# EAGLE design EEG-EMG_V1 (EAGLE 7.6.0)
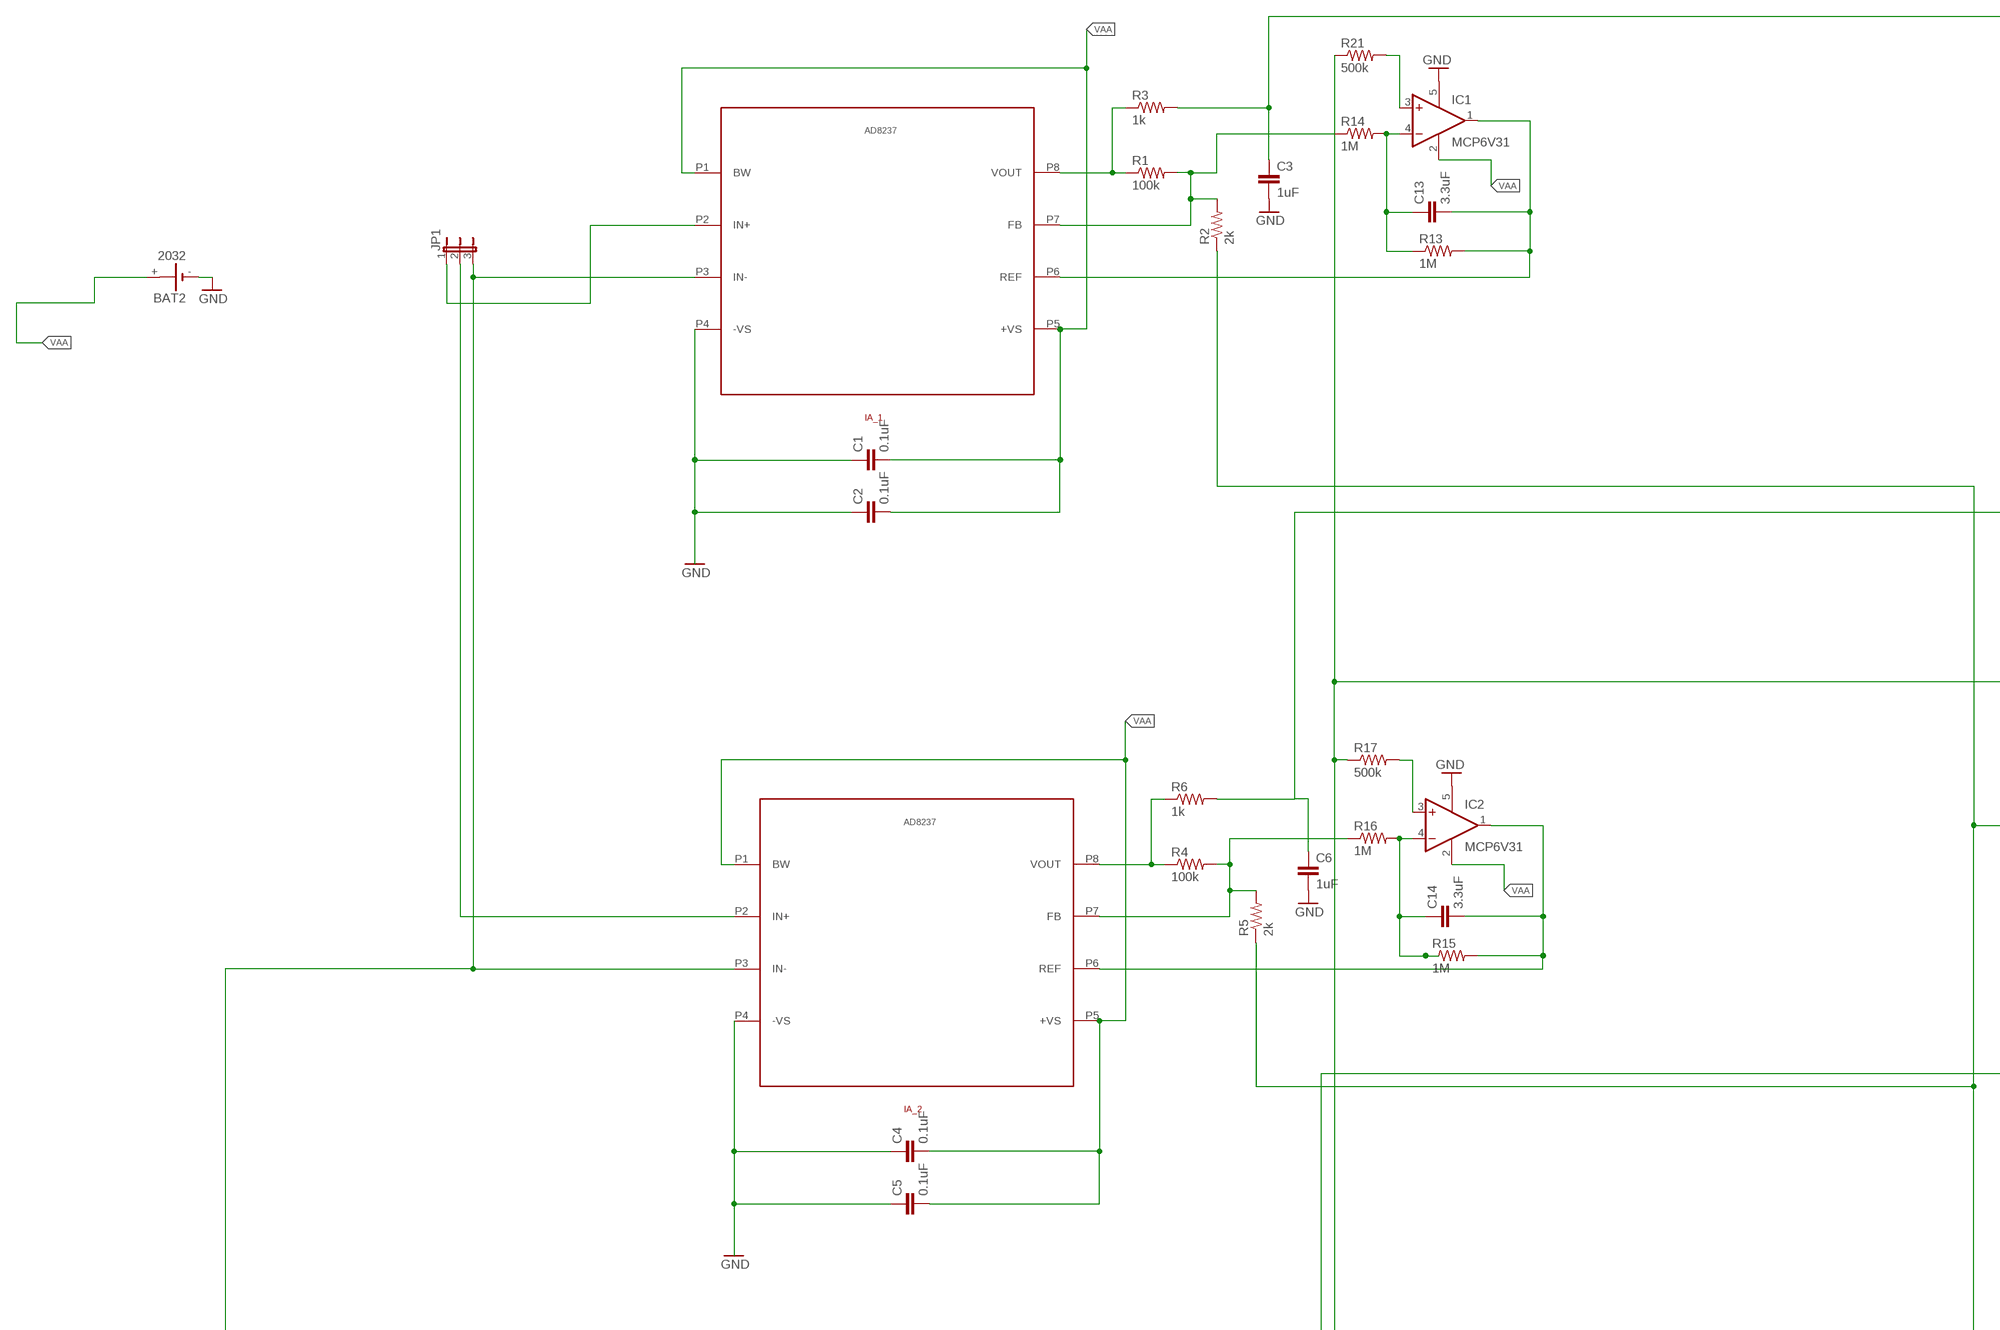
[diagram p0: schematic, sheet 1, part 1 of 3]
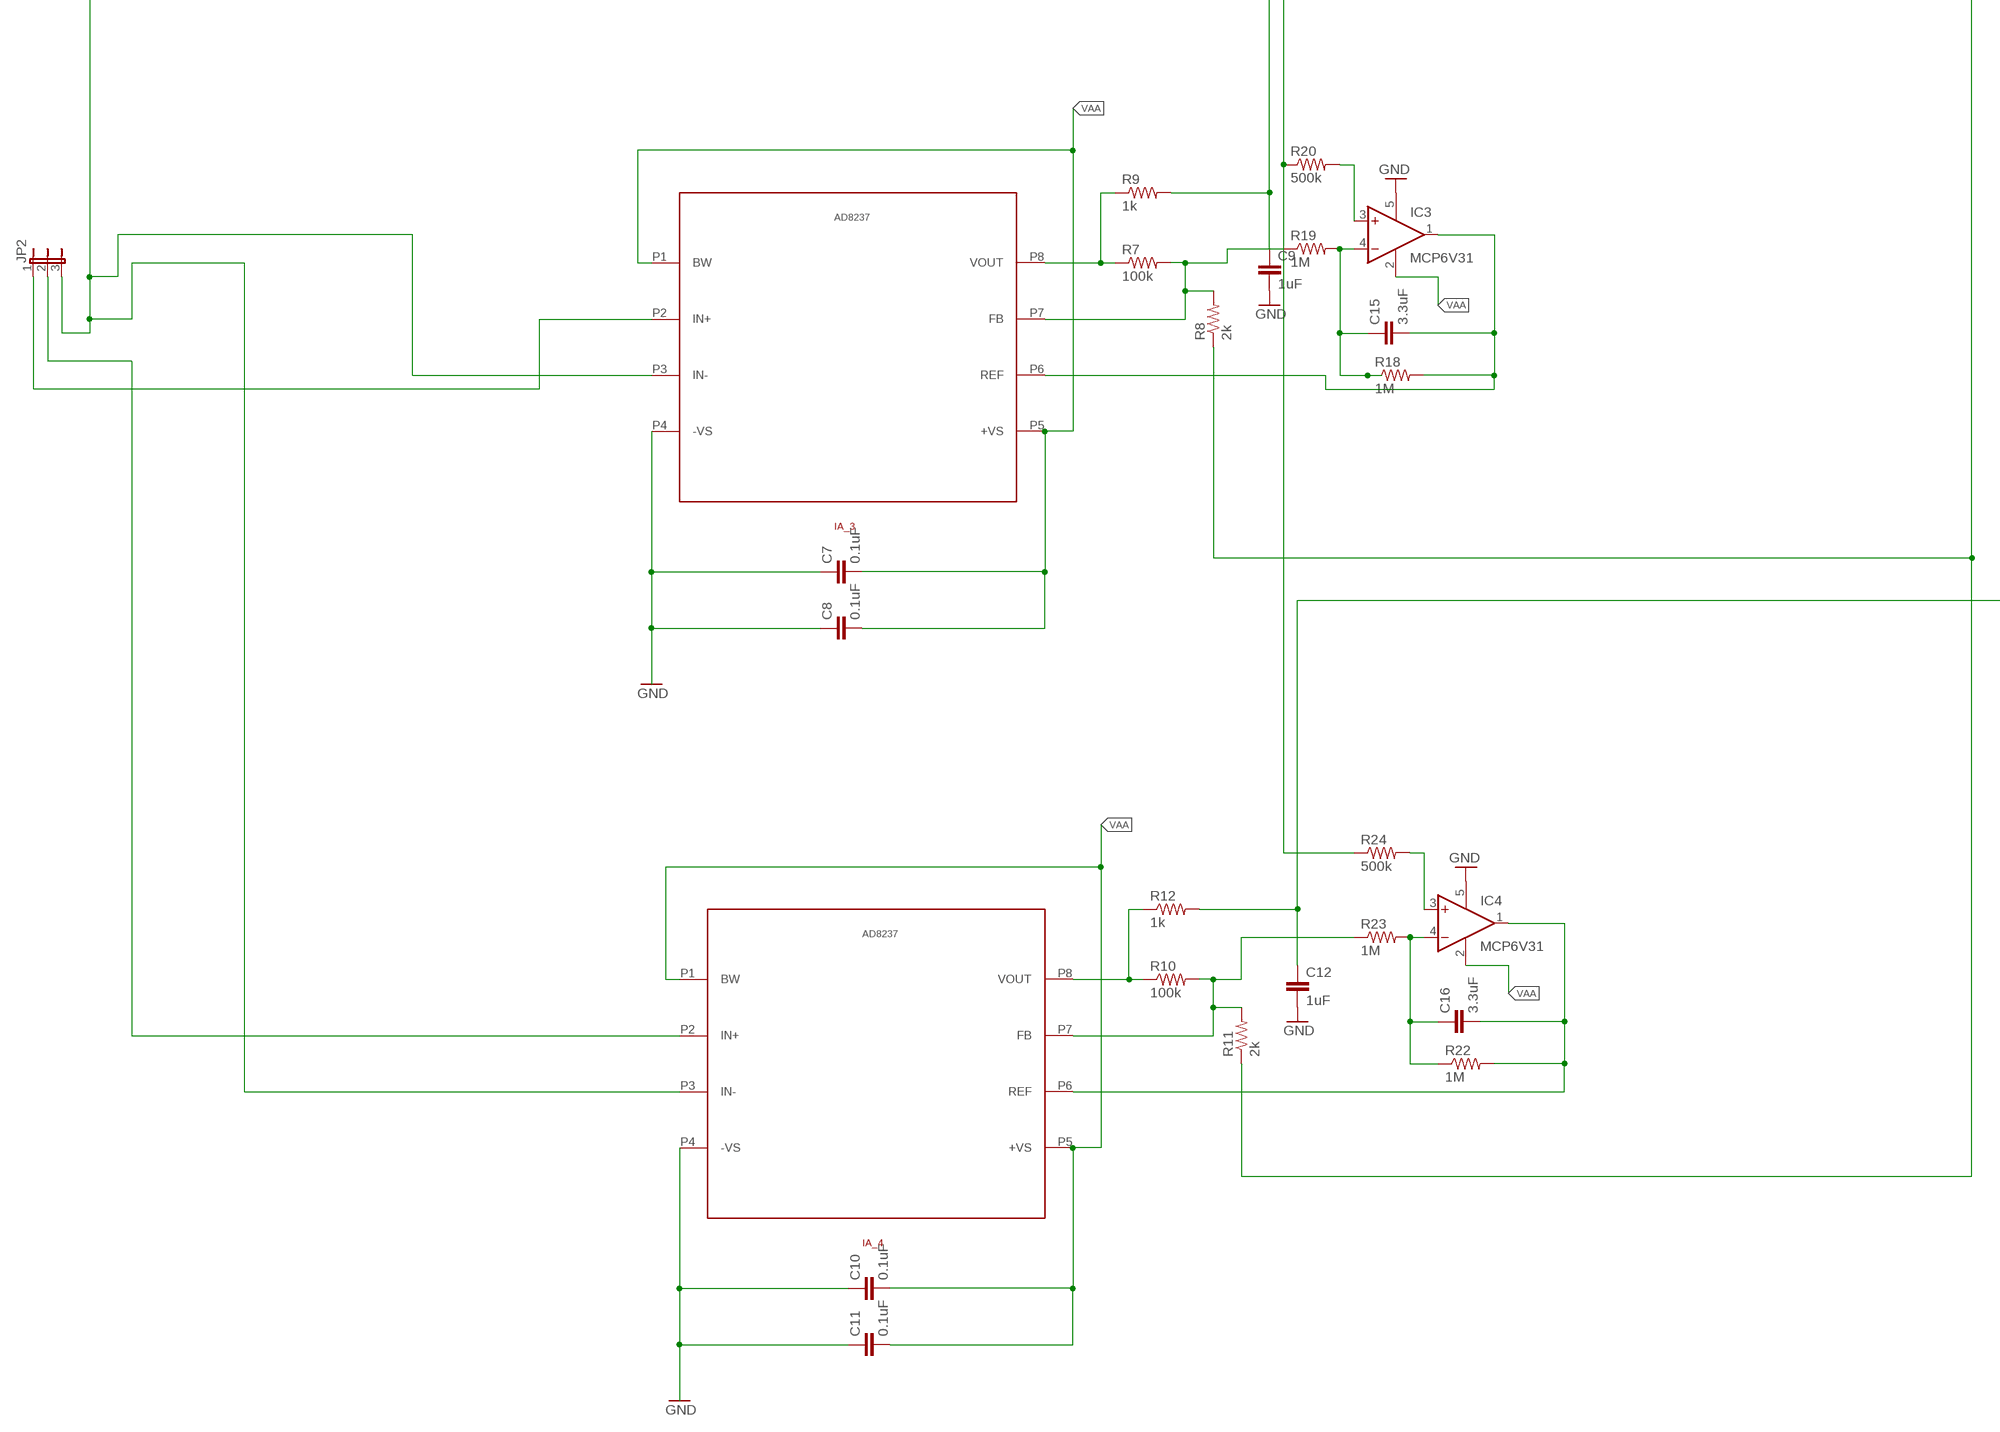
[diagram p1: schematic, sheet 1, part 2 of 3]
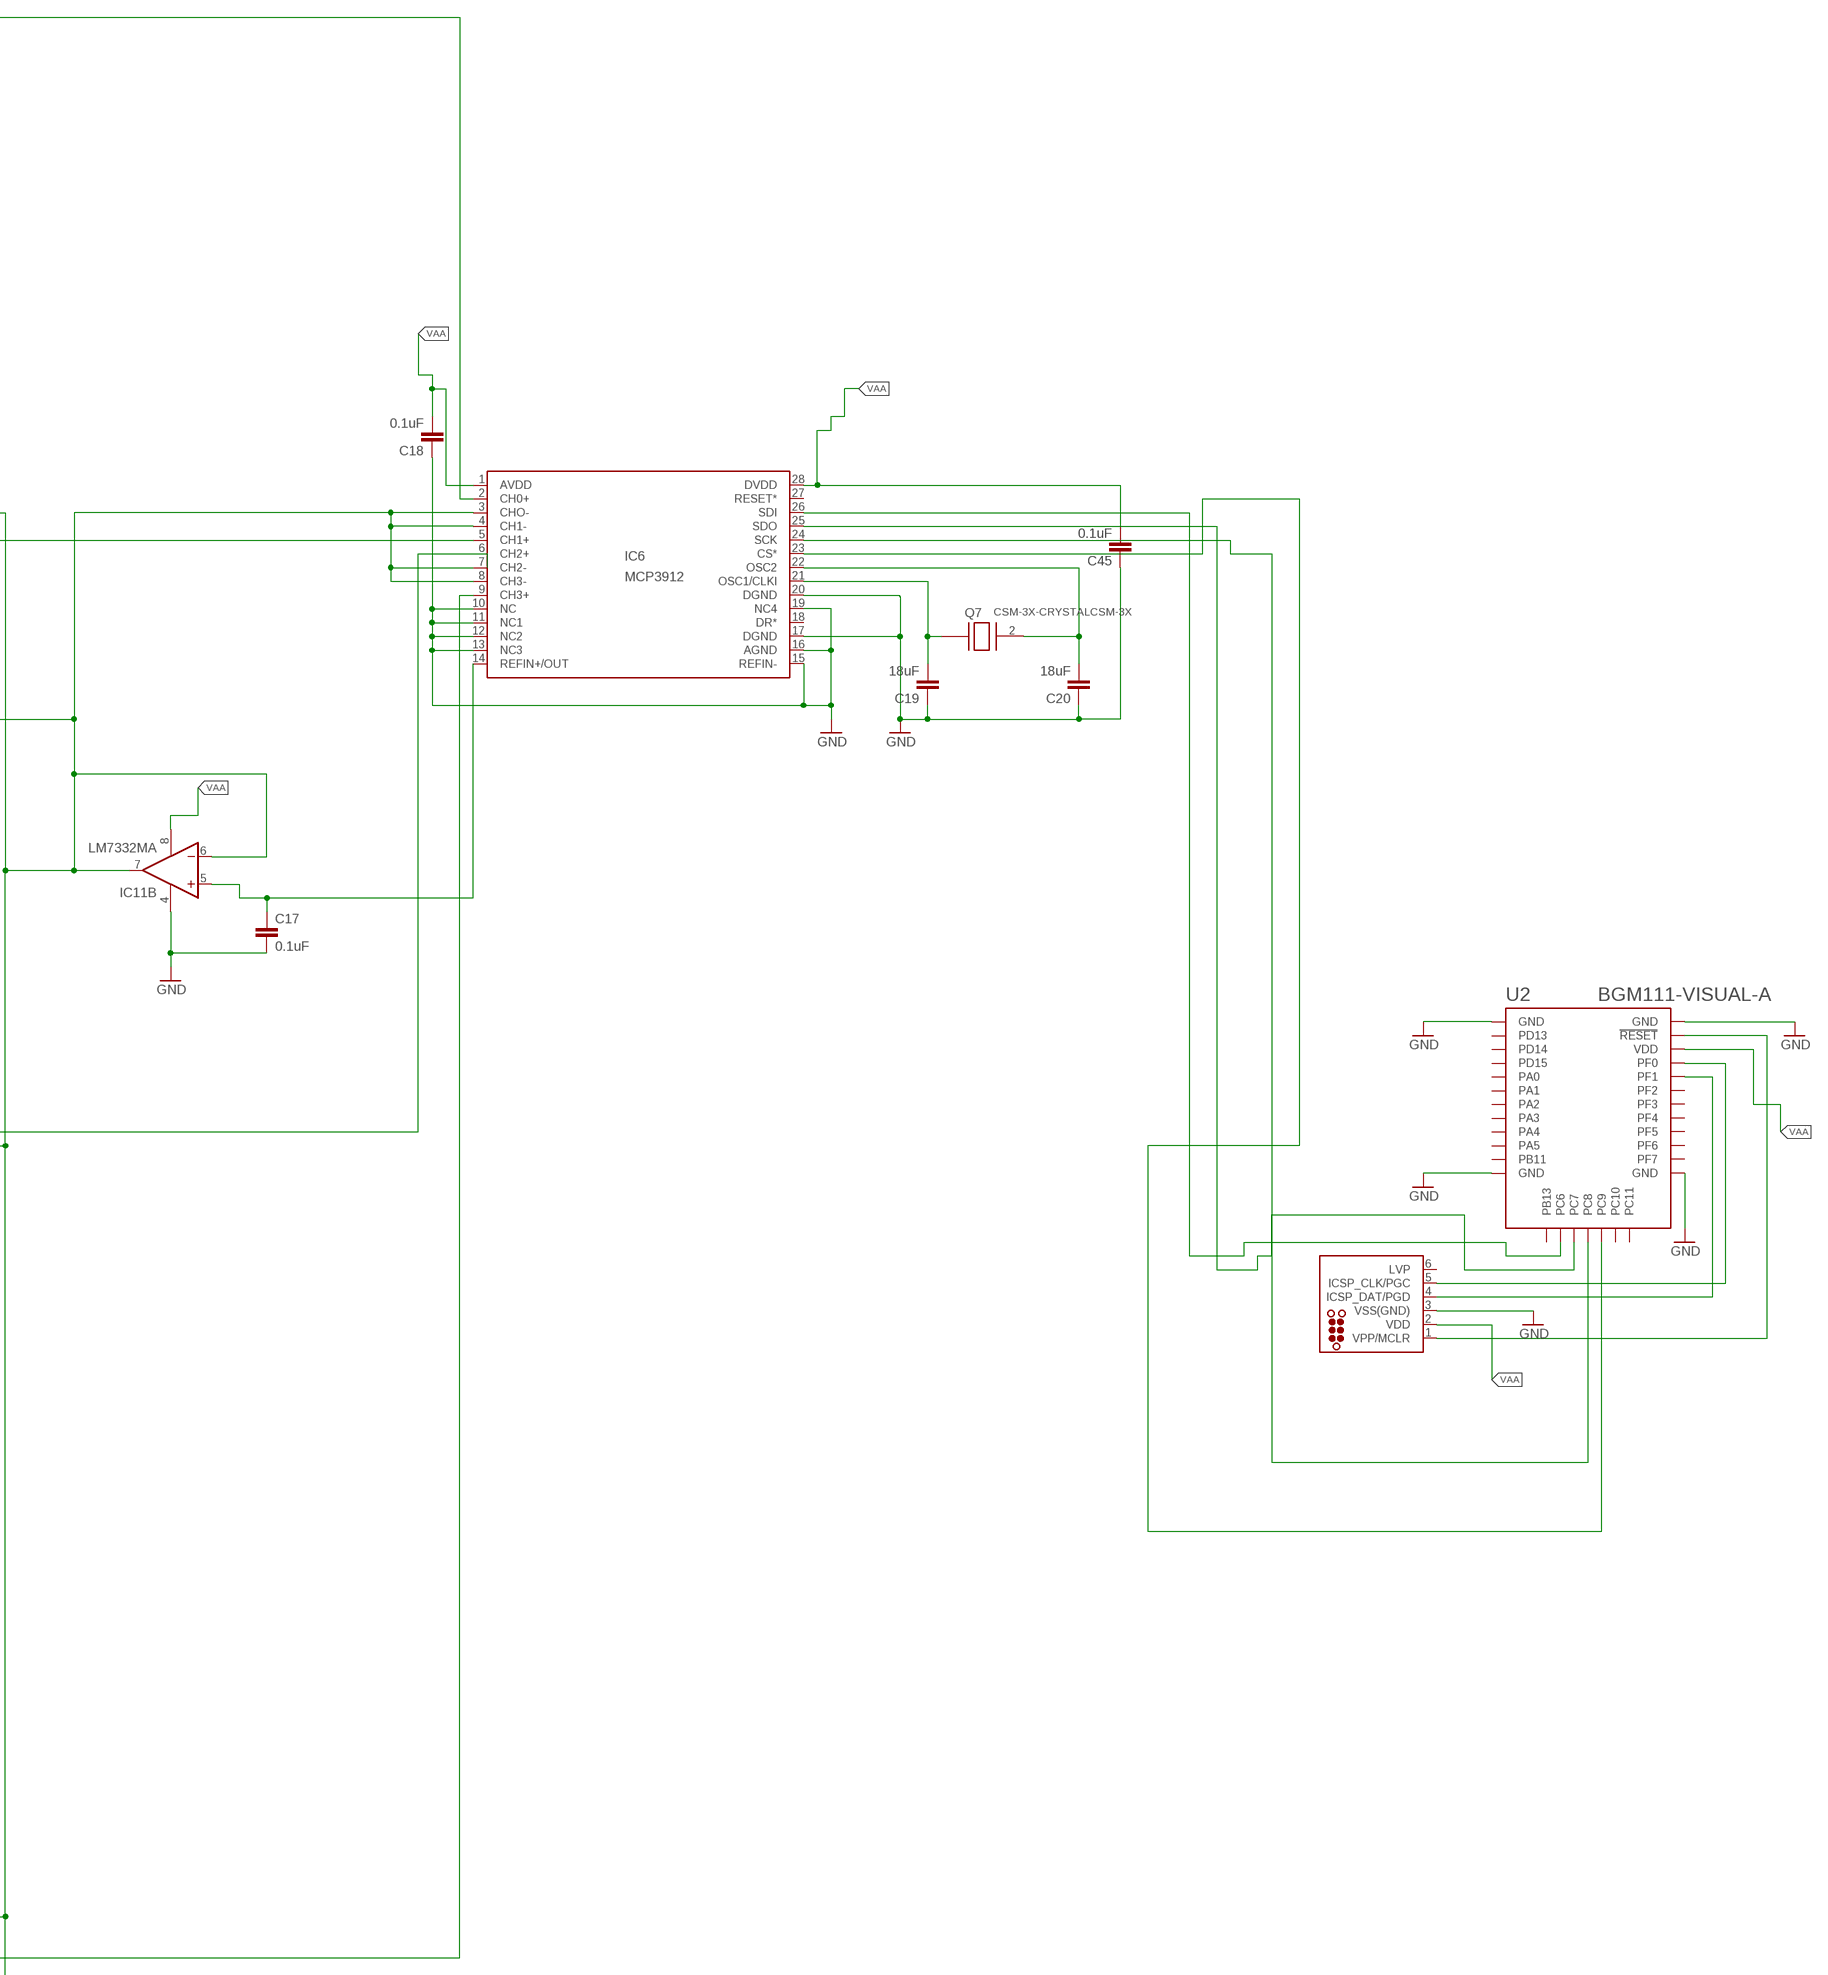
[diagram p2: schematic, sheet 1, part 3 of 3]

## Parts
BAT2  2032  [KZH20SMD]
C1  0.1uF  CAP0805  [0805]
C2  0.1uF  CAP0805  [0805]
C3  1uF  CAP0805  [0805]
C4  0.1uF  CAP0805  [0805]
C5  0.1uF  CAP0805  [0805]
C6  1uF  CAP0805  [0805]
C7  0.1uF  CAP0805  [0805]
C8  0.1uF  CAP0805  [0805]
C9  1uF  CAP0805  [0805]
C10  0.1uF  CAP0805  [0805]
C11  0.1uF  CAP0805  [0805]
C12  1uF  CAP0805  [0805]
C13  3.3uF  CAP0805  [0805]
C14  3.3uF  CAP0805  [0805]
C15  3.3uF  CAP0805  [0805]
C16  3.3uF  CAP0805  [0805]
C17  0.1uF  CAP0805  [0805]
C18  0.1uF  CAP0805  [0805]
C19  18uF  CAP0805  [0805]
C20  18uF  CAP0805  [0805]
C45  0.1uF  CAP0805  [0805]
IA_1  AD8237  [MSOP8]
IA_2  AD8237  [MSOP8]
IA_3  AD8237  [MSOP8]
IA_4  AD8237  [MSOP8]
IC1  MCP6V31  MCP601OT  [SOT23-5]
IC2  MCP6V31  MCP601OT  [SOT23-5]
IC3  MCP6V31  MCP601OT  [SOT23-5]
IC4  MCP6V31  MCP601OT  [SOT23-5]
IC6  MCP3912  [SSOP28]
IC11  LM7332MA  LM1458D  [SO08]
J2  TC2030-MCP-NL  [TC2030-MCP-NL]
JP1  JP2W  [JP2W]
JP2  JP2W  [JP2W]
Q7  CSM-3X-CRYSTALCSM-3X  [CSM-3X]
R1  100k  RESISTOR0805-RES  [0805]
R2  2k  RESISTOR0805-RES  [0805]
R3  1k  RESISTOR0805-RES  [0805]
R4  100k  RESISTOR0805-RES  [0805]
R5  2k  RESISTOR0805-RES  [0805]
R6  1k  RESISTOR0805-RES  [0805]
R7  100k  RESISTOR0805-RES  [0805]
R8  2k  RESISTOR0805-RES  [0805]
R9  1k  RESISTOR0805-RES  [0805]
R10  100k  RESISTOR0805-RES  [0805]
R11  2k  RESISTOR0805-RES  [0805]
R12  1k  RESISTOR0805-RES  [0805]
R13  1M  RESISTOR0805-RES  [0805]
R14  1M  RESISTOR0805-RES  [0805]
R15  1M  RESISTOR0805-RES  [0805]
R16  1M  RESISTOR0805-RES  [0805]
R17  500k  RESISTOR0805-RES  [0805]
R18  1M  RESISTOR0805-RES  [0805]
R19  1M  RESISTOR0805-RES  [0805]
R20  500k  RESISTOR0805-RES  [0805]
R21  500k  RESISTOR0805-RES  [0805]
R22  1M  RESISTOR0805-RES  [0805]
R23  1M  RESISTOR0805-RES  [0805]
R24  500k  RESISTOR0805-RES  [0805]
U2  BGM111-VISUAL-A  [BGM111-A]

## Nets
EEG1+: IA_1.P2(IN+) JP1.1
EEG2+: IA_2.P2(IN+) JP1.2
EMG1+: IA_3.P2(IN+) JP2.1
EMG2+: IA_4.P2(IN+) JP2.2
GND: BAT2.- C1.1 C2.1 C3.2 C4.1 C5.1 C6.2 C7.1 C8.1 C9.2 C10.1 C11.1 C12.2 C17.2 C18.1 C19.1 C20.1 C45.1 IA_1.P4(-VS) IA_2.P4(-VS) IA_3.P4(-VS) IA_4.P4(-VS) IC1.5(V+) IC2.5(V+) IC3.5(V+) IC4.5(V+) IC6.10(NC) IC6.11(NC1) IC6.12(NC2) IC6.13(NC3) IC6.15(REFIN-) IC6.16(AGND) IC6.17(DGND) IC6.19(NC4) IC6.20(DGND) IC11.4(P:V-) J2.3(VSS(GND)) U2.GND U2.GND@2(GND) U2.GND@3(GND) U2.GND@4(GND)
N$1: IA_1.P8(VOUT) R1.1 R3.1
N$2: IA_1.P7(FB) R1.2 R2.2 R14.1
N$3: C3.1 IC6.2(CH0+) R3.2
N$4: IA_2.P8(VOUT) R4.1 R6.1
N$5: IA_2.P7(FB) R4.2 R5.2 R16.1
N$6: C6.1 IC6.5(CH1+) R6.2
N$7: IA_3.P8(VOUT) R7.1 R9.1
N$8: IA_3.P7(FB) R7.2 R8.2 R19.1
N$9: C9.1 R9.2
N$10: IA_4.P8(VOUT) R10.1 R12.1
N$11: IA_4.P7(FB) R10.2 R11.2 R23.1
N$12: C12.1 IC6.9(CH3+) R12.2
N$13: C13.1 IC1.4(-IN) R13.1 R14.2
N$14: C13.2 IA_1.P6(REF) IC1.1(OUT) R13.2
N$15: C17.1 IC6.14(REFIN+/OUT) IC11.5(B:+IN)
N$16: C14.1 IC2.4(-IN) R15.1 R16.2
N$17: C14.2 IA_2.P6(REF) IC2.1(OUT) R15.2
N$18: IC6.3(CHO-) IC6.4(CH1-) IC6.7(CH2-) IC6.8(CH3-) IC11.6(B:-IN) IC11.7(B:OUT) R2.1 R5.1 R8.1 R11.1 R17.1 R20.1 R21.1 R24.1
N$19: C15.1 IC3.4(-IN) R18.1 R19.2
N$20: C15.2 IA_3.P6(REF) IC3.1(OUT) R18.2
N$21: IC2.3(+IN) R17.2
N$22: C16.1 IC4.4(-IN) R22.1 R23.2
N$23: C16.2 IA_4.P6(REF) IC4.1(OUT) R22.2
N$24: IC3.3(+IN) R20.2
N$25: IC1.3(+IN) R21.2
N$26: IC4.3(+IN) R24.2
N$27: IC6.26(SDI) U2.PC6
N$28: IC6.25(SDO) U2.PC7
N$29: IC6.24(SCK) U2.PC8
N$30: IC6.23(CS*) U2.PC9
N$110: J2.1(VPP/MCLR) U2.RESET
N$111: J2.5(ICSP_CLK/PGC) U2.PF0
N$112: J2.4(ICSP_DAT/PGD) U2.PF1
N$134: C19.2 IC6.21(OSC1/CLKI) Q7.1
N$135: C20.2 IC6.22(OSC2) Q7.2
REF: IA_1.P3(IN-) IA_2.P3(IN-) IA_3.P3(IN-) IA_4.P3(IN-) JP1.3 JP2.3
VAA: BAT2.+ C1.2 C2.2 C4.2 C5.2 C7.2 C8.2 C10.2 C11.2 C18.2 C45.2 IA_1.P1(BW) IA_1.P5(+VS) IA_2.P1(BW) IA_2.P5(+VS) IA_3.P1(BW) IA_3.P5(+VS) IA_4.P1(BW) IA_4.P5(+VS) IC1.2(V-) IC2.2(V-) IC3.2(V-) IC4.2(V-) IC6.1(AVDD) IC6.28(DVDD) IC11.8(P:V+)
VDD: J2.2(VDD) U2.VDD
Unconnected: IC6.6(CH2+) IC6.18(DR*) IC6.27(RESET*) IC11.1(A:OUT) IC11.2(A:-IN) IC11.3(A:+IN) J2.6(LVP) U2.PA0 U2.PA1 U2.PA2 U2.PA3 U2.PA4 U2.PA5 U2.PB11 U2.PB13 U2.PC10 U2.PC11 U2.PD13 U2.PD14 U2.PD15 U2.PF2 U2.PF3 U2.PF4 U2.PF5 U2.PF6 U2.PF7

## Library data of the parts
BAT2 = SMTU-2032-1:2032
C1-C20 C45 = SparkFun-Capacitors:CAP: Capacitor Standard 0603 ceramic capacitor, and 0.1" leaded capacitor.
IA_1-IA_4 = wts_transmitter:AD8237
IC1-IC4 = linear:MCP601: Single Op Amp 2.7V to 6.0V Single Supply CMOS Source: http://ww1.microchip.com/downloads/en/DeviceDoc/21314g.pdf
IC6 = SensorCape:MCP3912: edit this description Auto generated by make-symbol-device-package-bsdl.ulp Rev. 43 Source:
IC11 = linear:*1458: OP AMP
J2 = tag-connect:TC2030: TAG-CONNECT ICSP Connector Manufacturer: Tag-Connect <http://www.tag-connect.com> Cable for easy In-Circuit Serial Programming. Designed for Microchip ICD2, suitable for many others. Two variants - one "with legs" (for hands-free fit on PCB) and another "without legs" for quick programming. PAD Description 1 MCLR/Vpp 2 Vdd 3 GND 4 PGD (ISPDAT) 5 PGC (ISPCLK) 6 nc (used for LVP) ©2009 ROFA.cz - modified and updated by Robert Darlington ‹rdarlington@gmail.com›
JP1 JP2 = jumper:JP2W: JUMPER
Q7 = fmc:CSM-3X-CRYSTAL
R1-R24 = SparkFun-Passives:RESISTOR: Resistor Basic schematic elements and footprints for 0603, 1206, and PTH resistors.
U2 = sf-bluegiga:BGM111-VISUAL: Bluetooth 4.1 (4.2 ready) low-energy module (Bluetooth Smart) - BGM111-A variant has an on-module ceramic chip antenna. BGM111-A variant includes keepout/restrict area. Antenna edge of the module should be flush up against the edge of the PCB. See datasheet for variant layout details. IT IS EXTREMELY IMPORTANT THAT YOU FOLLOW THE LAYOUT GUIDELINES FOR THIS MODULE IN ORDER TO ENSURE MAXIMUM RANGE. THIS MEANS THAT YOU NEED A SOLID GROUND PLANE EXTENDING IDEALLY 17 mm ON THE LEFT AND RIGHT SIDES OF THE MODULE, AS SHOWN IN THE DATASHEET. The Silicon Labs Blue Gecko BGM111 Bluetooth® Smart module integrates our next generation wireless SoC with a complete Bluetooth Smart software stack and antenna to provide a complete, pre-certified plug-and-play Bluetooth Smart solution. It solves one of the major customer roadblocks for fast time-to-market as it integrates antenna, software and RF certifications, saving months of engineering effort and testing. https://www.silabs.com/products/wireless/bluetooth/Pages/BGM111-bluetooth-smart-module.aspx https://github.com/jrowberg/sf-oshw Last updated 2015-09-02 by Jeff Rowberg <jeff@rowberg.net>; ANTENNA: On-module ceramic chip antenna

## Board
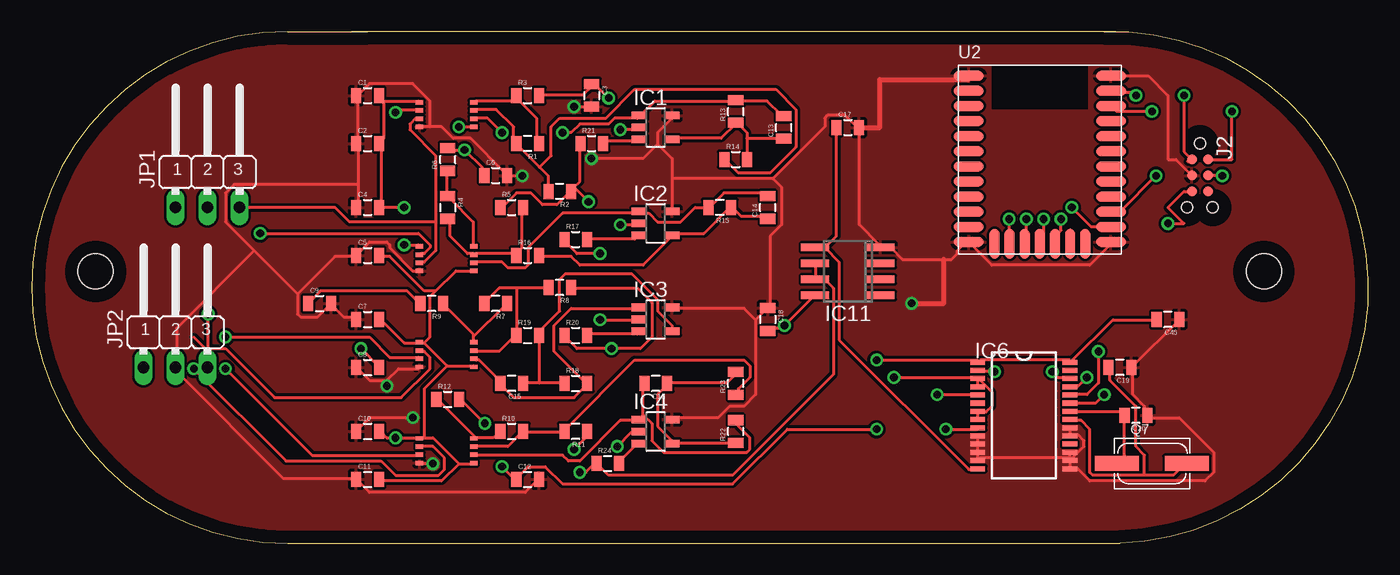
[diagram p3: board, top side]
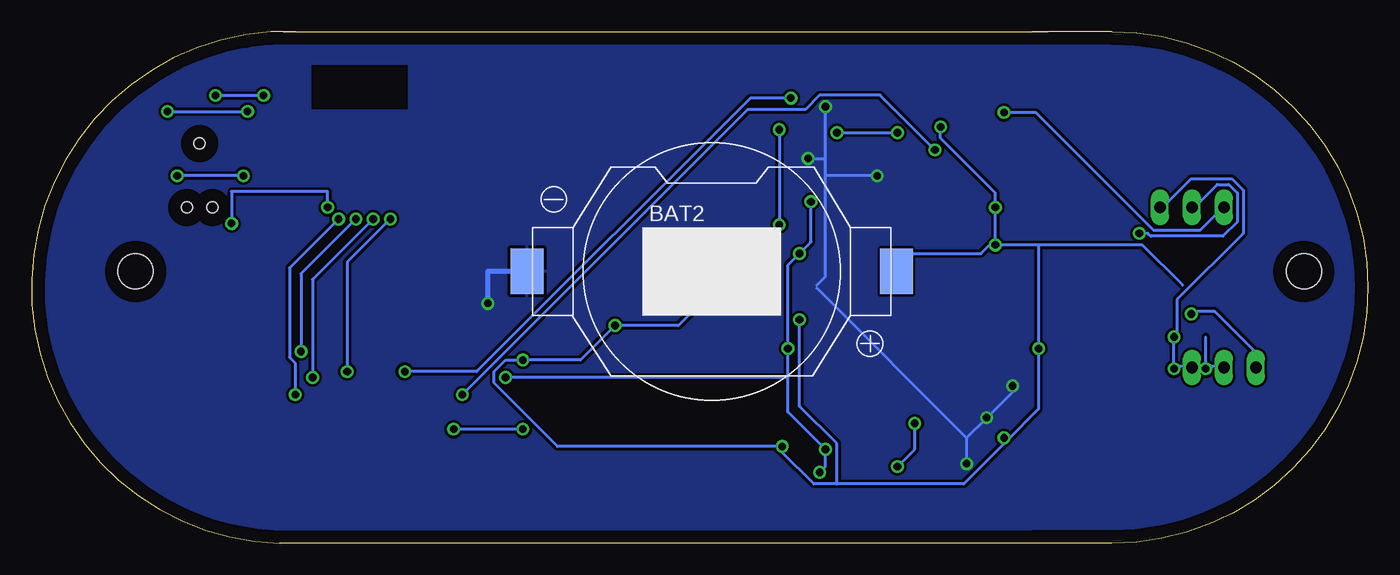
[diagram p4: board, bottom side, seen from below]

Size 106.04 x 40.64 mm. Coordinates in mm from the lower left corner, seen from the top.
Outline: 86.03,40.63 25.4,40.63
Outline: 26.67,40.64 20.32,40.64 arc180 20.32,0 26.67,0 86.36,0 arc180 85.09,40.64
Copper layers (1*16): Top 0.035mm / dielectric 1.5mm / Bottom 0.035mm
Design rules "default": minimum track width 10mil, minimum drill 24mil, track to track 8mil, track to pad 8mil, pad to pad 8mil, via to via 8mil, smd to smd 8mil, copper to edge 40mil, drill to drill 8mil, minimum pad ring 10mil, minimum via ring 8mil, stop-mask expansion 4mil, vias tented up to drill 0mil, thermal gap 10mil
Holes 2.8 mm at 5.08,21.59 97.79,21.59

### Footprints (pad centres in the part's own frame; a part is rotated, then mirrored left to right if it is on the bottom)
KZH20SMD = smd 2.6 x 3.6: + 14.65,0; - -14.65,0
0805 = smd 0.8 x 1.2: 1 -0.9,0; 2 0.9,0
MSOP8 = smd 0.35 x 0.6: P1 0.55,0.3; P2 1.2,0.3; P3 1.85,0.3; P4 2.5,0.3; P5 2.5,4.6; P6 1.85,4.6; P7 1.2,4.6; P8 0.55,4.6
SOT23-5 = smd 0.6 x 1.2: 1 -0.95,-1.306; 2 0,-1.306; 3 0.95,-1.306; 4 0.95,1.306; 5 -0.95,1.306
SSOP28 = smd 1.154 x 0.4: 1 -3.65,4.225; 2 -3.65,3.575; 3 -3.65,2.925; 4 -3.65,2.275; 5 -3.65,1.625; 6 -3.65,0.975; 7 -3.65,0.325; 8 -3.65,-0.325; 9 -3.65,-0.975; 10 -3.65,-1.625; 11 -3.65,-2.275; 12 -3.65,-2.925; 13 -3.65,-3.575; 14 -3.65,-4.225; 15 3.65,-4.225; 16 3.65,-3.575; 17 3.65,-2.925; 18 3.65,-2.275; 19 3.65,-1.625; 20 3.65,-0.975; 21 3.65,-0.325; 22 3.65,0.325; 23 3.65,0.975; 24 3.65,1.625; 25 3.65,2.275; 26 3.65,2.925; 27 3.65,3.575; 28 3.65,4.225
SO08 = smd 0.6 x 2.2: 1 -1.905,-2.6; 2 -0.635,-2.6; 3 0.635,-2.6; 4 1.905,-2.6; 5 1.905,2.6; 6 0.635,2.6; 7 -0.635,2.6; 8 -1.905,2.6
TC2030-MCP-NL = smd 0.787 x 0.787: 1 1.27,-0.635; 2 1.27,0.635; 3 2.54,-0.635; 4 2.54,0.635; 5 3.81,-0.635; 6 3.81,0.635 | hole 0.889: 0,0; 5.08,-1.016; 5.08,1.016
JP2W = drill 0.914 long: 1 -2.54,-1.27; 2 0,-1.27; 3 2.54,-1.27
CSM-3X = smd 3.5 x 1.2: 1 2.775,0; 2 -2.775,0
BGM111-A = smd 2.4 x 0.8: GND -5.65,6.65; GND@2 -5.65,-6.55; GND@3 5.65,-6.55; GND@4 5.65,6.65; PA0 -5.65,1.85; PA1 -5.65,0.65; PA2 -5.65,-0.55; PA3 -5.65,-1.75; PA4 -5.65,-2.95; PA5 -5.65,-4.15; PB11 -5.65,-5.35; PD13 -5.65,5.45; PD14 -5.65,4.25; PD15 -5.65,3.05; PF0 5.65,-5.35; PF1 5.65,-4.15; PF2 5.65,-2.95; PF3 5.65,-1.75; PF4 5.65,-0.55; PF5 5.65,0.65; PF6 5.65,1.85; PF7 5.65,3.05; RESET 5.65,5.45; VDD 5.65,4.25 | smd 0.8 x 2.4: PB13 -3.6,-6.7; PC6 -2.4,-6.7; PC7 -1.2,-6.7; PC8 0,-6.7; PC9 1.2,-6.7; PC10 2.4,-6.7; PC11 3.6,-6.7

### Placement (x,y rotation side)
BAT2  52.07,21.59 0 bottom
C1  26.67,35.56 0 top
C2  26.67,31.75 0 top
C3  44.45,35.56 270 top
C4  26.67,26.67 0 top
C5  26.67,22.86 0 top
C6  36.83,29.21 0 top
C7  26.67,17.78 0 top
C8  26.67,13.97 0 top
C9  22.86,19.05 0 top
C10  26.67,8.89 0 top
C11  26.67,5.08 0 top
C12  39.37,5.08 0 top
C13  59.69,33.02 90 top
C14  58.42,26.67 90 top
C15  38.1,12.7 180 top
C16  49.53,12.7 180 top
C17  64.77,33.02 0 top
C18  58.42,17.78 270 top
C19  86.36,13.97 180 top
C20  87.63,10.16 180 top
C45  90.17,17.78 180 top
IA_1  30.48,35.56 270 top
IA_2  30.48,24.13 270 top
IA_3  30.48,16.51 270 top
IA_4  30.48,8.89 270 top
IC1  49.53,33.02 270 top
IC2  49.53,25.4 270 top
IC3  49.53,17.78 270 top
IC4  49.53,8.89 270 top
IC6  78.74,10.16 0 top
IC11  64.77,21.59 90 top
J2  92.71,31.75 270 top
JP1  13.97,27.94 0 top
JP2  11.43,15.24 0 top
Q7  88.9,6.35 0 top
R1  39.37,31.75 180 top
R2  41.91,27.94 180 top
R3  39.37,35.56 0 top
R4  33.02,26.67 270 top
R5  38.1,26.67 0 top
R6  33.02,30.48 90 top
R7  36.83,19.05 180 top
R8  41.91,20.32 180 top
R9  31.75,19.05 180 top
R10  38.1,8.89 0 top
R11  43.18,8.89 180 top
R12  33.02,11.43 0 top
R13  55.88,34.29 90 top
R14  55.88,30.48 0 top
R15  54.61,26.67 180 top
R16  39.37,22.86 0 top
R17  43.18,24.13 0 top
R18  43.18,12.7 0 top
R19  39.37,16.51 0 top
R20  43.18,16.51 0 top
R21  44.45,31.75 0 top
R22  55.88,8.89 90 top
R23  55.88,12.7 90 top
R24  45.72,6.35 0 top
U2  80.01,30.48 0 top

### Tracks (layer width: path | path; a pad name or v marks a point on that pad's centre or on a via)
EEG1+  (via drill 0.61)
  Top 0.254: v28.88,34.21 29.11,34.44 30.71,34.44 IA_1.P2
  Bottom 0.254: v28.88,34.21 26.37,34.21 16.99,24.84 13.33,24.84 11.51,26.67 JP1.1
EEG2+  (via drill 0.61)
  Top 0.254: v18.14,24.61 30.71,24.61 31.62,23.7 31.62,23.47 31.17,23.01 30.94,23.01 IA_2.P2
  Bottom 0.254: v18.14,24.61 17.45,24.61 17.22,24.38 11.51,24.38 10.36,25.53 10.36,27.81 11.05,28.5 11.96,28.5 13.79,26.67 JP1.2
EMG1+  (via drill 0.61)
  Top 0.254: 14.02,15.47 13.79,15.47 12.88,16.38 | 14.02,15.47 15.39,15.47 19.28,11.58 29.34,11.58 31.62,13.87 31.62,14.78 31.17,15.24 30.94,15.24 IA_3.P2 | 14.02,15.47 v14.02,18.21
  Bottom 0.254: v14.02,18.21 13.79,18.44 12.19,18.44 8.99,15.24 8.99,14.1 JP2.1
EMG2+  (via drill 0.61)
  Top 0.254: v12.88,13.87 20.19,6.55 27.74,6.55 28.88,5.41 32.31,5.41 32.77,5.87 32.77,6.78 31.85,7.7 30.94,7.7 IA_4.P2
  Bottom 0.254: 12.88,14.1 12.88,16.38 | 12.88,14.1 11.51,14.1 JP2.2 | 12.88,14.1 v12.88,13.87
GND  (via drill 0.6, 0.61)
  Top 0.254: 28.19,12.95 29.11,13.87 30.71,13.87 IA_3.P4 | 28.19,12.95 26.82,12.95 25.91,13.87 C8.1 | v31.85,6.33 30.94,6.33 IA_4.P4 | v30.25,9.98 26.82,9.98 25.91,9.07 C10.1 | v43.05,34.67 44.42,34.67 C3.2 | v28.19,12.5 28.19,12.95 | C12.2 40.08,4.95 39.17,4.04 26.82,4.04 25.91,4.95 C11.1 25.68,5.18 19.96,5.18 11.51,13.64 11.51,17.07 17.68,23.24 | C7.1 25.68,17.98 24.77,17.98 23.85,18.9 C9.2 23.62,18.9 22.71,17.98 21.34,17.98 21.11,18.21 21.11,19.81 | IA_2.P4 30.71,21.64 30.25,21.64 28.42,23.47 28.42,23.7 28.19,23.93 26.82,23.93 25.91,23.01 C5.1 25.68,22.78 24.08,22.78 21.11,19.81 | 25.91,28.5 25.91,31.7 C2.1 25.91,31.93 25.91,35.36 C1.1 25.91,35.59 26.82,36.5 30.25,36.5 31.62,35.13 31.62,33.07 | 25.91,28.5 25.91,26.67 C4.1 | 31.62,33.07 32.54,33.07 33.45,32.16 34.82,32.16 37.57,29.41 C6.2 37.8,29.19 v38.94,29.19 | 31.62,33.07 30.94,33.07 IA_1.P4 | 17.68,23.24 15.39,25.53 15.39,27.81 16.08,28.5 25.91,28.5 | 17.68,23.24 21.11,19.81 | 57.45,17.76 57.45,11.81 56.54,10.9 55.4,10.9 54.48,9.98 51.05,9.98 IC4.5 | 57.45,17.76 58.37,18.67 C18.1 58.6,18.9 58.6,24.38 59.51,25.3 59.51,28.27 58.83,28.96 | 57.45,17.76 56.54,18.67 51.05,18.67 IC3.5 | 50.82,28.96 50.82,30.56 49.68,31.7 | 50.82,28.96 50.82,26.44 IC2.5 | 49.68,31.7 49.68,32.61 50.82,33.76 IC1.5 | 58.83,28.96 50.82,28.96 | 58.83,28.96 62.94,33.07 62.94,33.76 63.17,33.98 64.54,33.98 65.46,33.07 C17.2 65.68,32.84 65.68,25.3 67.28,23.7 IC11.4 67.51,23.47 68.2,23.47 69.11,22.56 72.39,22.56 73,22.56 73.46,23.01 73.46,23.24 74.14,23.93 U2.GND@2 74.37,23.93 76.2,22.1 83.97,22.1 85.8,23.93 U2.GND@3 | 75.06,7.24 75.06,6.78 IC6.13 75.29,6.78 82.37,6.78
  Top 0.254: IC6.10 75.06,8.38 75.06,7.93 IC6.11 75.06,7.7 75.06,7.24 | 75.06,7.24 IC6.12 | IC6.20 82.37,9.07 82.37,8.61 IC6.19 82.6,8.61 83.06,8.61 83.52,8.15 83.52,7.7 82.6,6.78 IC6.16 | IC6.16 82.37,6.55 82.37,6.1 IC6.15 82.6,5.87 83.06,5.87 83.97,4.95 93.12,4.95 93.8,5.64 93.8,7.24 91.06,9.98 88.54,9.98 C20.1 88.32,10.21 88.32,10.9 87.4,11.81 87.4,13.87 C19.1 87.4,14.1 91.06,17.76 C45.1 | 82.37,6.78 82.37,7.24 IC6.17 | 82.37,6.78 IC6.16 | v44.42,30.56 48.54,30.56 49.68,31.7 | U2.GND@4 88.6,37.13 90.17,35.56 90.17,30.48 90.81,30.48 J2.3
  Top 0.406: C17.2 67.31,33.02 67.31,36.83 74.36,36.83 U2.GND | v69.85,19.05 72.39,19.05 72.39,22.56
  Bottom 0.254: 31.85,8.38 v31.85,6.33 | 43.74,20.27 31.85,8.38 | 31.85,8.38 v30.25,9.98 28.19,12.04 v28.19,12.5 | 43.05,29.19 43.05,21.18 43.74,20.5 | 43.05,29.19 43.05,30.56 | 43.05,30.56 v43.05,34.67 | v38.94,29.19 43.05,29.19 | v44.42,30.56 43.05,30.56
  Bottom 0.406: BAT2.- 69.85,21.59 v69.85,19.05
  pour Bottom: -1.27,40.64 109.22,40.64 109.22,-1.27 -1.27,-1.27
  pour Top: -1.27,40.64 109.22,40.64 109.22,39.37 109.22,-1.27 -1.27,-1.27 -1.27,2.54
N$1
  Top 0.254: IA_1.P8 35.28,35.13 38.02,35.13 38.25,35.36 R3.1 38.48,35.36 40.08,33.76 40.08,31.93 R1.1
N$2
  Top 0.254: IA_1.P7 35.28,34.44 36.88,34.44 38.25,33.07 38.25,31.93 R1.2 38.48,31.7 40.31,29.87 | 40.31,29.87 41,29.19 41,28.04 R2.2 | 40.31,29.87 41.22,30.78 41.22,33.07 41.91,33.76 45.57,33.76 47.85,36.04 59.05,36.04 60.65,34.44 60.65,31.47 58.6,29.41 56.08,29.41 55.17,30.33 R14.1
N$3  (via drill 0.61)
  Top 0.254: v76.43,13.64 75.29,13.64 IC6.2 | v45.8,35.36 44.65,36.5 C3.1 44.42,36.27 43.74,35.59 40.31,35.59 R3.2
  Bottom 0.254: v76.43,13.64 70.71,13.64 49,35.36 v45.8,35.36
N$4
  Top 0.254: IA_2.P8 35.05,23.7 35.05,25.53 33.22,27.36 R4.1 32.99,27.58 32.99,29.41 R6.1
N$5
  Top 0.254: R4.2 33.22,25.76 33.22,24.38 34.59,23.01 35.05,23.01 IA_2.P7 35.28,23.01 38.25,23.01 R16.1 38.48,23.01 38.94,23.47 38.94,26.67 R5.2
N$6  (via drill 0.61)
  Top 0.254: v71.86,11.81 75.06,11.81 IC6.5 | R6.2 33.22,31.24 v34.37,31.24 35.74,29.87 35.74,29.41 C6.1
  Bottom 0.254: v71.86,11.81 49.22,34.44 44.65,34.44 43.51,35.59 38.71,35.59 v34.37,31.24
N$7
  Top 0.254: 35.05,16.38 35.05,16.61 32.77,18.9 R9.1 | 35.05,16.38 35.05,15.93 IA_3.P8 | 35.05,16.38 37.57,18.9 R7.1
N$8
  Top 0.254: IA_3.P7 35.28,15.24 37.11,15.24 38.25,16.38 R19.1 38.48,16.61 38.48,20.27 | 38.48,20.27 41,20.27 R8.2 | 38.48,20.27 37.11,20.27 35.97,19.13 R7.2
N$9
  Top 0.254: C9.1 22.02,19.13 22.94,20.04 29.79,20.04 30.71,19.13 R9.2
N$10
  Top 0.254: 35.28,8.38 36.65,8.38 37.11,8.84 R10.1 | 35.28,8.38 32.31,11.35 R12.1 | 35.28,8.38 IA_4.P8
N$11
  Top 0.254: IA_4.P7 35.28,7.7 37.8,7.7 38.94,8.84 R10.2 39.17,8.84 42.14,8.84 R11.2 42.37,9.07 47.85,14.55 56.54,14.55 57,14.1 57,13.18 56.08,12.27 56.08,11.81 R23.1
N$12  (via drill 0.61)
  Top 0.254: v72.54,9.07 75.06,9.07 IC6.9 | v67.06,9.07 59.97,9.07 55.63,4.72 42.14,4.72 40.77,6.1 39.39,6.1 38.48,5.18 C12.1 38.25,5.18 v37.34,6.1 | v35.97,9.53 34.14,11.35 R12.2
  Bottom 0.254: v67.06,9.07 v72.54,9.07 | v35.97,9.53 35.97,7.47 v37.34,6.1
N$13
  Top 0.254: 56.77,32.16 56.77,32.61 56.08,33.3 R13.1 55.85,33.3 54.71,32.16 51.05,32.16 IC1.4 | 56.77,32.16 56.77,30.56 R14.2 | 56.77,32.16 59.51,32.16 C13.1
N$14  (via drill 0.61)
  Top 0.254: C13.2 59.51,33.98 58.37,35.13 56.08,35.13 R13.2 55.85,35.13 49.45,35.13 48.31,33.98 IC1.1 48.08,33.76 46.25,33.76 45.8,33.3 43.51,33.3 42.82,32.61 v42.14,32.61 | v37.34,32.61 36.2,33.76 35.28,33.76 IA_1.P6
  Bottom 0.254: v42.14,32.61 v37.34,32.61
N$15
  Top 0.254: 62.94,23.47 64.08,22.33 64.08,16.15 74.37,5.87 75.06,5.87 IC6.14 | 62.94,23.47 62.25,23.47 IC11.5 62.94,23.47 | 62.94,23.47 63.86,24.38 63.86,32.84 C17.1
N$16
  Top 0.254: C14.1 58.37,25.98 56.31,25.98 55.63,26.67 R15.1 55.4,26.67 53.34,24.61 51.05,24.61 IC2.4 50.82,24.38 48.54,22.1 43.51,22.1 42.82,22.78 40.31,22.78 R16.2
N$17
  Top 0.254: C14.2 58.37,27.58 58.14,27.81 54.94,27.81 53.8,26.67 R15.2 52.65,26.67 51.51,25.53 49.68,25.53 49,26.21 48.31,26.21 IC2.1 48.08,26.21 42.14,26.21 39.39,23.47 39.39,22.1 39.17,21.87 37.8,21.87 37.34,22.33 35.28,22.33 IA_2.P6
N$18  (via drill 0.61)
  Top 0.254: R5.1 37.34,26.67 38.48,27.81 39.62,27.81 40.54,26.9 41.68,26.9 42.6,27.81 R2.1 | 43.05,28.27 42.82,28.04 R2.1 | 43.05,28.27 43.51,28.73 43.51,31.7 R21.1 | R20.1 42.37,16.38 43.28,15.47 v46.02,15.47 48.31,15.47 49.22,16.38 49.22,19.13 48.08,20.27 42.82,20.27 R8.1 | IC6.8 75.06,9.98 75.06,10.44 IC6.7 75.29,10.44 75.74,10.44 76.2,10.9 76.2,12.04 75.29,12.95 IC6.3 | IC6.4 75.06,12.5 75.06,12.95 IC6.3 | 62.25,20.96 62.94,20.96 63.63,20.27 63.63,13.41 55.63,5.41 45.8,5.41 44.88,6.33 R24.1 44.65,6.33 43.97,5.64 v43.51,5.64 | v43.05,7.47 43.97,8.38 43.97,8.84 R11.1 | v45.11,23.01 43.28,23.01 42.37,23.93 R17.1 | 62.25,20.96 62.25,22.1 IC11.6 | 62.25,20.96 IC11.7 | v68.43,13.18 75.06,13.18 IC6.3 | v44.2,27.13 43.05,28.27 | 43.05,28.27 R2.1
  Bottom 0.254: v43.51,5.64 43.05,6.1 v43.05,7.47 46.02,10.44 46.02,13.18 | 46.02,13.18 v46.02,15.47 46.02,22.1 v45.11,23.01 44.2,23.93 v44.2,27.13 | 46.02,13.18 v68.43,13.18
N$19
  Top 0.254: 40.31,12.73 42.14,12.73 R18.1 | 40.31,12.73 39.17,12.73 C15.1 | 40.31,12.73 40.31,16.38 R19.2 40.08,16.61 41.91,18.44 41.91,20.96 42.37,21.41 47.62,21.41 49.68,19.36 49.68,18.44 50.82,17.3 50.82,16.84 IC3.4
N$20
  Top 0.254: IA_3.P6 35.28,14.55 35.51,14.55 37.34,12.73 C15.2 37.34,12.5 38.25,11.58 43.05,11.58 43.97,12.5 R18.2 43.97,12.73 41.45,15.24 41.45,17.3 42.82,18.67 48.08,18.67 IC3.1
N$21
  Top 0.254: R17.2 44.2,24.16 47.85,24.16 48.08,24.38 IC2.3
N$22
  Top 0.254: R22.1 55.85,7.93 51.05,7.93 IC4.4 50.82,8.15 49.68,9.3 49.68,11.81 50.37,12.5 C16.1 50.6,12.73 55.17,12.73 55.85,13.41 R23.2
N$23
  Top 0.254: IA_4.P6 35.28,7.01 42.14,7.01 42.6,6.55 43.51,6.55 46.71,9.75 48.08,9.75 IC4.1 48.31,9.98 48.54,10.21 | 48.54,10.21 48.54,12.5 C16.2 | 48.54,10.21 49.22,9.53 49.22,8.15 50.14,7.24 56.77,7.24 57,7.47 57,8.38 56.08,9.3 56.08,9.75 R22.2
N$24
  Top 0.254: R20.2 44.2,16.61 48.08,16.61 IC3.3
N$25
  Top 0.254: R21.2 45.57,31.93 48.08,31.93 IC1.3
N$26
  Top 0.254: R24.2 46.71,6.55 48.08,7.93 IC4.3
N$27  (via drill 0.61)
  Top 0.254: v81,13.64 81.46,13.18 82.37,13.18 IC6.26 | v77.57,25.76 77.57,23.93 U2.PC6
  Bottom 0.254: v81,13.64 81,22.33 v77.57,25.76
N$28  (via drill 0.61)
  Top 0.254: v83.74,13.18 83.06,12.5 82.6,12.5 IC6.25 | v78.94,25.76 78.94,23.93 U2.PC7
  Bottom 0.254: v83.74,13.18 83.74,20.96 v78.94,25.76
N$29  (via drill 0.61)
  Top 0.254: v84.66,15.24 84.66,12.73 83.74,11.81 82.6,11.81 IC6.24 | v80.31,25.76 80.31,24.16 80.09,23.93 U2.PC8
  Bottom 0.254: v84.66,15.24 84.66,21.41 v80.31,25.76
N$30  (via drill 0.61)
  Top 0.254: v85.12,11.81 84.43,11.12 82.6,11.12 IC6.23 | v81.69,25.76 81.69,24.84 81.23,24.38 81.23,23.93 U2.PC9
  Bottom 0.254: v85.12,11.81 85.12,14.33 85.57,14.78 85.57,21.87 v81.69,25.76
N$110  (via drill 0.6)
  Top 0.254: 91.75,30.33 91.97,30.33 J2.1 91.44,31.12 v91.44,35.56 | U2.RESET 85.8,35.81 87.38,35.81 v87.63,35.56
  Bottom 0.254: v87.63,35.56 v91.44,35.56
N$111  (via drill 0.6)
  Top 0.254: U2.PF0 84.09,25.13 v82.55,26.67 | v90.17,25.4 91.44,25.4 90.17,26.67 91.44,27.94 J2.5
  Bottom 0.254: v82.55,26.67 82.55,27.94 90.17,27.94 v90.17,25.4
N$112  (via drill 0.61)
  Top 0.254: v94.49,29.19 93.34,29.19 J2.4 | v89.23,29.19 86.49,26.44 85.8,26.44 U2.PF1
  Bottom 0.254: v89.23,29.19 v94.49,29.19
N$134
  Top 0.254: 88.32,5.41 90.6,5.41 91.52,6.33 Q7.1 | 88.32,5.41 84.2,5.41 83.97,5.64 83.97,9.07 83.29,9.75 82.6,9.75 IC6.21 | 88.32,5.41 88.32,7.01 87.63,7.7 87.63,10.9 85.57,12.95 85.57,13.87 C19.2
N$135
  Top 0.254: IC6.22 82.6,10.44 86.49,10.44 86.72,10.21 C20.2 86.72,9.98 86.72,7.01 86.26,6.55 Q7.2
REF  (via drill 0.61)
  Top 0.254: v15.39,13.87 22.25,7.01 30.71,7.01 IA_4.P3 | v15.39,16.38 26.82,16.38 28.42,14.78 30.71,14.78 IA_3.P3 | 32.08,25.53 32.08,30.78 30.02,32.84 30.02,33.3 30.48,33.76 30.71,33.76 IA_1.P3 | 32.08,25.53 32.08,23.24 31.17,22.33 30.94,22.33 IA_2.P3 | JP1.3 24.08,26.67 25.22,25.53 32.08,25.53
  Bottom 0.254: JP1.3 16.31,26.67 14.02,28.96 10.82,28.96 9.91,28.04 9.91,24.61 15.16,19.36 15.16,16.61 v15.39,16.38 15.39,14.1 | 15.39,14.1 14.02,14.1 JP2.3 | 15.39,14.1 v15.39,13.87
VAA  (via drill 0.61)
  Top 0.254: C45.2 89.23,17.76 85.8,17.76 82.6,14.55 IC6.28 82.37,14.55 75.29,14.55 IC6.1 75.06,14.55 v67.06,14.55 | C18.2 58.6,17.07 59.51,17.07 v59.74,17.3 62.03,19.58 IC11.8 | v46.71,25.3 48.08,25.3 IC2.2 | v46.71,32.84 48.08,32.84 IC1.2 | C10.2 27.74,8.84 28.19,8.38 v28.88,8.38 30.71,8.38 IA_4.P1 30.94,8.38 31.17,8.38 | 33.91,6.33 35.05,6.33 IA_4.P5 | 33.91,6.33 31.85,8.38 31.17,8.38 | 33.91,6.33 32.54,4.95 27.74,4.95 C11.2 | C7.2 27.74,17.76 29.57,15.93 30.71,15.93 IA_3.P1 30.94,15.93 31.17,15.93 | 32.99,14.1 35.05,14.1 IA_3.P5 | 31.17,15.93 32.99,14.1 | 32.08,20.04 31.62,19.58 31.62,16.38 31.17,15.93 | 32.08,20.04 33.68,21.64 35.05,21.64 IA_2.P5 | 32.08,20.04 31.17,20.04 28.42,22.78 27.74,22.78 C5.2 | 31.17,8.38 31.17,12.27 32.99,14.1 | 27.96,35.13 30.71,35.13 IA_1.P1 | 27.96,35.13 27.74,35.36 C1.2 27.96,35.13 | 27.74,26.67 27.74,31.7 C2.2 27.74,31.93 27.96,32.16 27.96,35.13 | v29.57,23.7 30.71,23.7 IA_2.P1 | v33.91,33.07 35.05,33.07 IA_1.P5 | v26.14,15.47 27.51,14.1 C8.2 | v46.48,7.7 47.62,8.84 48.08,8.84 IC4.2 | v45.11,17.76 48.08,17.76 IC3.2 | v29.57,26.67 27.74,26.67 | 27.74,26.67 C4.2
  Bottom 0.254: v46.71,32.84 v46.71,25.3 54.71,17.3 v59.74,17.3 62.48,14.55 v67.06,14.55 68.43,14.55 69.34,13.64 69.34,12.73 64.31,7.7 v46.48,7.7 46.48,7.24 43.97,4.72 42.14,4.72 | 26.14,23.7 17.91,23.7 14.71,20.5 | 26.14,23.7 v29.57,23.7 | v33.91,33.07 33.91,32.16 29.57,27.81 v29.57,26.67 v29.57,23.7 | 26.14,23.7 v26.14,15.47 26.14,10.67 28.65,8.15 | 42.14,4.72 32.08,4.72 28.65,8.15 | v45.11,17.76 45.11,10.9 42.14,7.93 42.14,4.72 | 28.65,8.15 v28.88,8.38 | v29.57,23.7 30.02,23.7 30.71,23.01 36.2,23.01 37.57,21.64 BAT2.+
VDD  (via drill 0.6)
  Top 0.254: J2.2 95.25,30.48 v95.25,34.29 | v88.9,34.29 86.1,34.29 U2.VDD
  Bottom 0.254: v95.25,34.29 v88.9,34.29